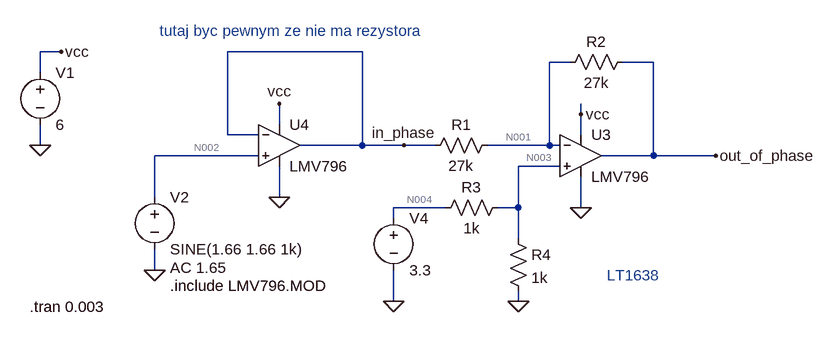
[diagram p0: schematic differential_output_lt1638.asc]
differential_output_lt1638.asc, the LTspice schematic file:
Version 4.1
SHEET 1 1144 680
WIRE -224 -96 -256 -96
WIRE 240 -96 32 -96
WIRE 560 -80 528 -80
WIRE 688 -80 640 -80
WIRE -256 -64 -256 -96
WIRE 576 0 576 -16
WIRE 112 16 112 -16
WIRE 32 32 32 -96
WIRE 80 32 32 32
WIRE 576 32 576 0
WIRE -256 48 -256 16
WIRE 240 48 240 -96
WIRE 240 48 144 48
WIRE 304 48 240 48
WIRE 352 48 304 48
WIRE 528 48 528 -80
WIRE 528 48 432 48
WIRE 544 48 528 48
WIRE 80 64 -80 64
WIRE 688 64 688 -80
WIRE 688 64 608 64
WIRE 784 64 688 64
WIRE 544 80 480 80
WIRE -80 128 -80 64
WIRE 112 128 112 80
WIRE 368 144 288 144
WIRE 480 144 480 80
WIRE 480 144 448 144
WIRE 576 144 576 96
WIRE 288 160 288 144
WIRE 480 192 480 144
WIRE -80 240 -80 208
WIRE 288 288 288 240
WIRE 480 288 480 272
FLAG -224 -96 vcc
FLAG 576 0 vcc
FLAG -80 240 0
FLAG 784 64 out_of_phase
FLAG 576 144 0
FLAG 288 288 0
FLAG -256 48 0
FLAG 112 -16 vcc
FLAG 112 128 0
FLAG 304 48 in_phase
FLAG 480 288 0
SYMBOL voltage -256 -80 R0
WINDOW 123 0 0 Left 0
WINDOW 39 0 0 Left 0
SYMATTR InstName V1
SYMATTR Value 6
SYMBOL voltage -80 112 R0
WINDOW 123 24 124 Left 2
WINDOW 39 0 0 Left 0
SYMATTR Value2 AC 1.65
SYMATTR InstName V2
SYMATTR Value SINE(1.66 1.66 1k)
SYMBOL res 448 32 R90
WINDOW 0 0 56 VBottom 2
WINDOW 3 32 56 VTop 2
SYMATTR InstName R1
SYMATTR Value 27k
SYMBOL res 656 -96 R90
WINDOW 0 0 56 VBottom 2
WINDOW 3 32 56 VTop 2
SYMATTR InstName R2
SYMATTR Value 27k
SYMBOL voltage 288 144 R0
WINDOW 123 0 0 Left 0
WINDOW 39 0 0 Left 0
SYMATTR InstName V4
SYMATTR Value 3.3
SYMBOL res 464 128 R90
WINDOW 0 0 56 VBottom 2
WINDOW 3 32 56 VTop 2
SYMATTR InstName R3
SYMATTR Value 1k
SYMBOL res 464 176 R0
SYMATTR InstName R4
SYMATTR Value 1k
SYMBOL OpAmps\\opamp2 576 0 R0
SYMATTR InstName U3
SYMATTR Value LMV796
SYMBOL OpAmps\\opamp2 112 -16 R0
SYMATTR InstName U4
SYMATTR Value LMV796
TEXT -272 296 Left 2 !.tran 0.003
TEXT 616 248 Left 2 ;LT1638
TEXT -72 -128 Left 2 ;tutaj byc pewnym ze nie ma rezystora
TEXT -56 264 Left 2 !.include LMV796.MOD

The netlist it stands for:
* differential_output_lt1638.asc
V1 vcc 0 6
V2 N002 0 SINE(1.66 1.66 1k) AC 1.65
R1 N001 in_phase 27k
R2 out_of_phase N001 27k
V4 N004 0 3.3
R3 N003 N004 1k
R4 N003 0 1k
X§U3 N003 N001 vcc 0 out_of_phase LMV796  ; pins In+ In- V+ V- OUT
X§U4 N002 in_phase vcc 0 in_phase LMV796  ; pins In+ In- V+ V- OUT
.tran 0.003
* LT1638
* tutaj byc pewnym ze nie ma rezystora
.include LMV796.MOD
.backanno
.end

* Results of the author's LTspice run, read from the files saved beside the schematic
* Operating Point, zero values left out:
*   V(n002) = 1.66 V
*   V(in_phase) = 1.66 V
*   V(out_of_phase) = 1.64 V
*   V(n003) = 1.65 V
*   V(vcc) = 6 V
*   V(n001) = 1.65 V
*   V(n004) = 3.3 V
*   I(V1) = -2.456 mA
*   I(R3) = -1.65 mA
*   I(R1) = -370.4 nA
*   I(V4) = -1.65 mA
*   I(R2) = -370.4 nA
*   I(R4) = 1.65 mA
*   I(V2) = 4.18 pA
*   Ix(u4:3) = -4.18 pA
*   Ix(u4:4) = -4.18 pA
*   Ix(u4:6) = 1.228 mA
*   Ix(u4:2) = -1.228 mA
*   Ix(u4:1) = -370.4 nA
*   Ix(u3:3) = -4.2 pA
*   Ix(u3:4) = -4.2 pA
*   Ix(u3:6) = 1.228 mA
*   Ix(u3:2) = -1.228 mA
*   Ix(u3:1) = 370.4 nA
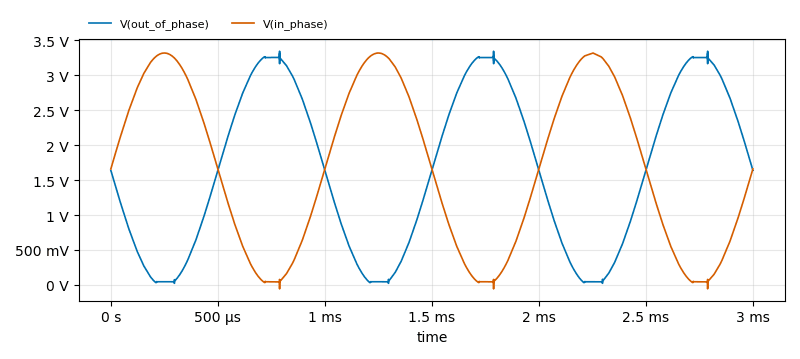
[diagram p1: Transient Analysis of differential_output_lt1638.asc, plotted from the saved traces]
* Transient Analysis, 1 run:
*   V(out_of_phase): min 22.03 mV, max 3.345 V, average 1.642 V, rms 2.014 V, last 1.64 V
*   V(in_phase): min -56.61 mV, max 3.32 V, average 1.662 V, rms 2.034 V, last 1.66 V